# Altium project EFNMR_RT_V1.PrjPcb
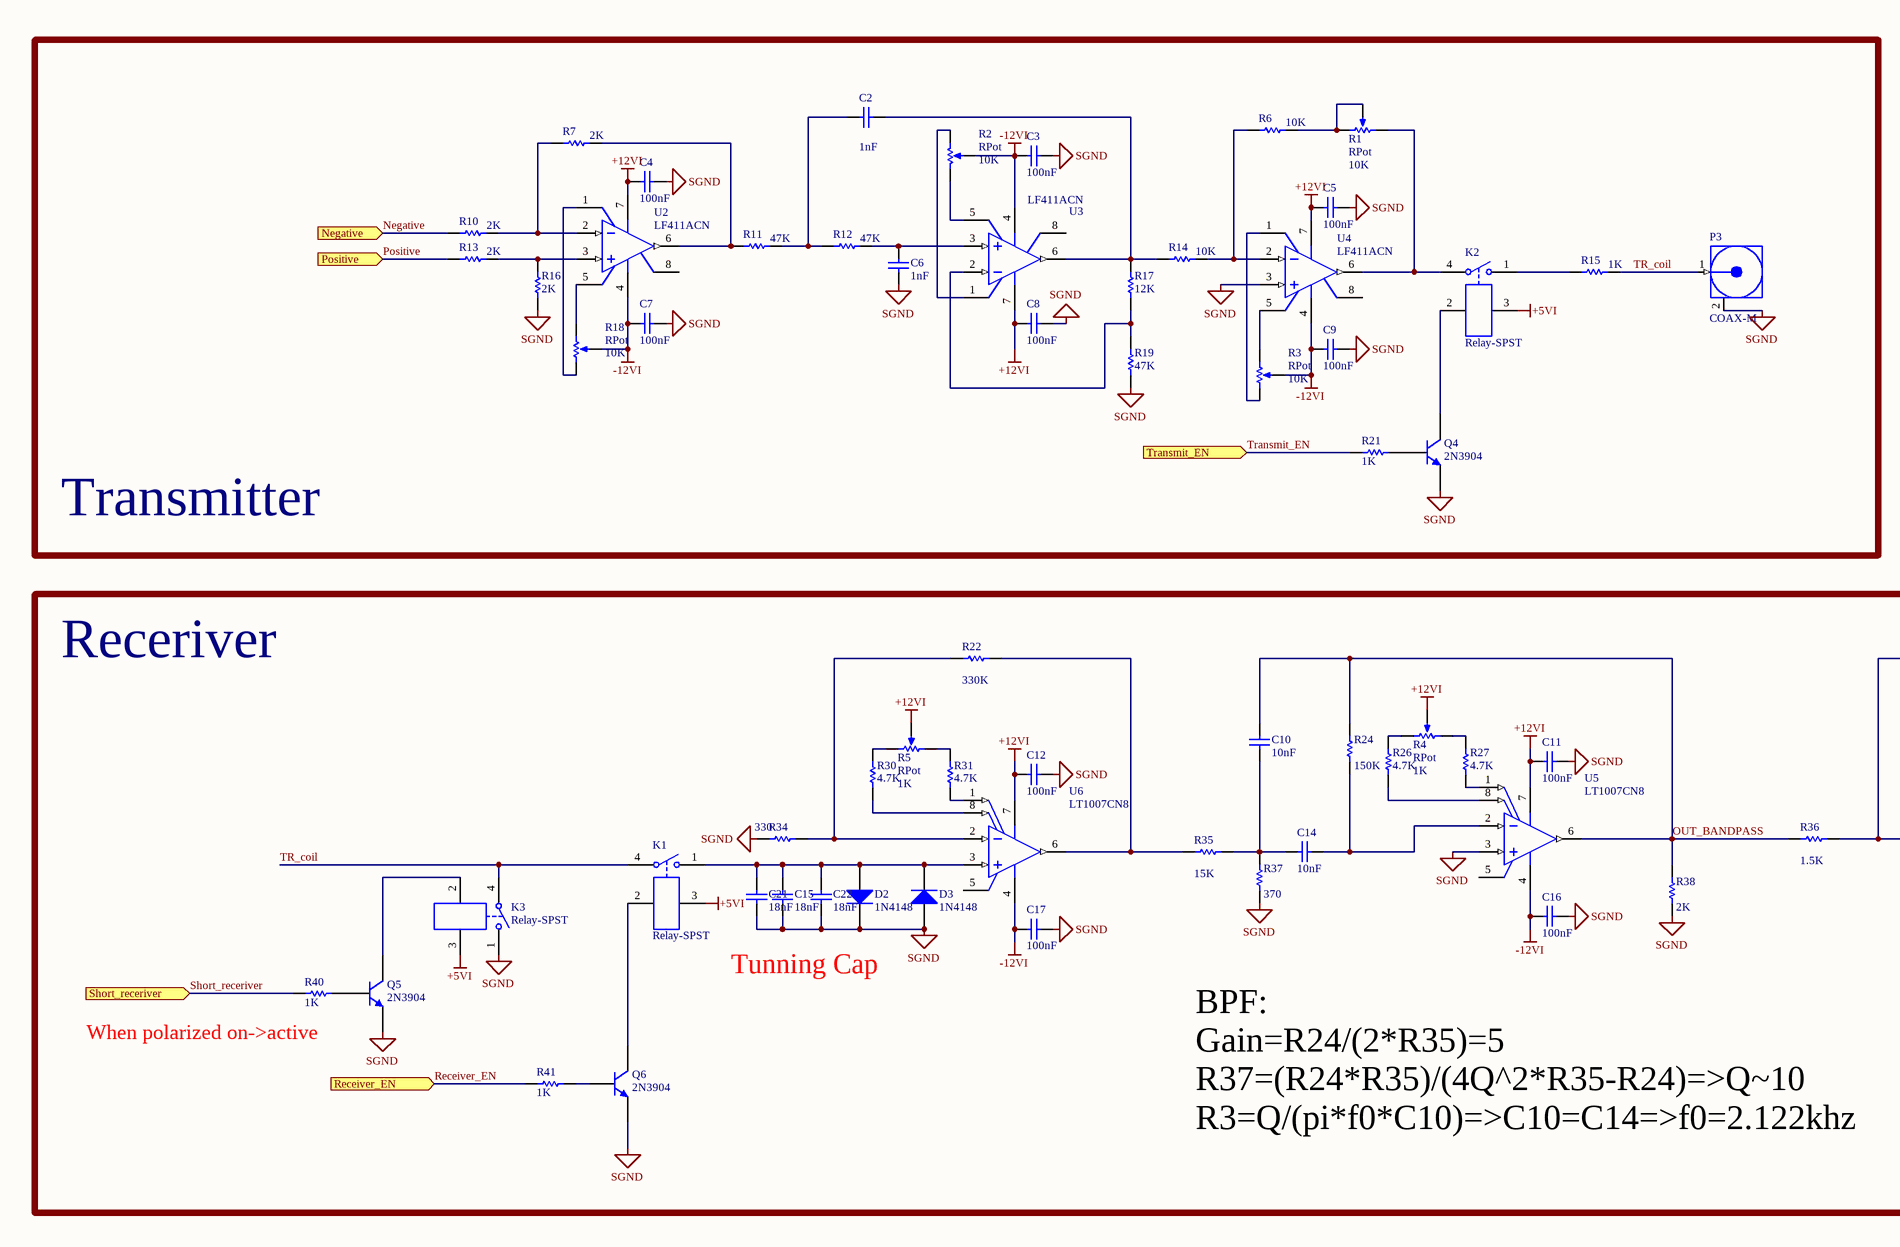
[diagram p0: EFNMR_RT_V1.SchDoc, left]
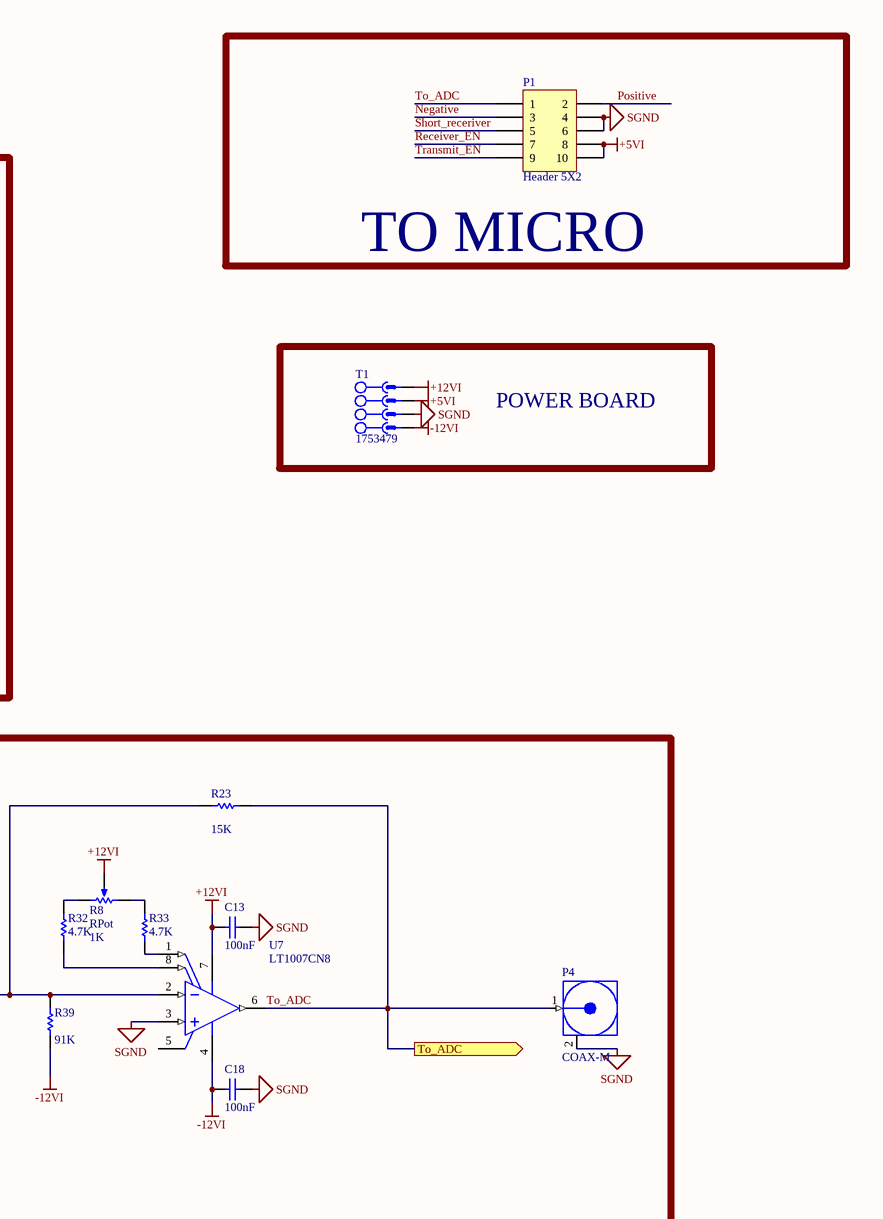
[diagram p1: EFNMR_RT_V1.SchDoc, right]
1 sheet, 73 parts. Net scope: flat (ports and power ports of the same name join across sheets).
Board file: EFNMR_RT_V1.PcbDoc

## Sheet EFNMR_RT_V1.SchDoc
size A2

### Parts
C2  value 1nF  [CAP0805]  (hidden comment: Cap)
C3  value 100nF  [CAP0805]  (hidden comment: Cap)
C4  value 100nF  [CAP0805]  (hidden comment: Cap)
C5  value 100nF  [CAP0805]  (hidden comment: Cap)
C6  value 1nF  [CAP0805]  (hidden comment: Cap)
C7  value 100nF  [CAP0805]  (hidden comment: Cap)
C8  value 100nF  [CAP0805]  (hidden comment: Cap)
C9  value 100nF  [CAP0805]  (hidden comment: Cap)
C10  10nF  [CAP0805]
C11  value 100nF  [CAP0805]  (hidden comment: Cap)
C12  value 100nF  [CAP0805]  (hidden comment: Cap)
C13  value 100nF  [CAP0805]  (hidden comment: Cap)
C14  10nF  [CAP0805]
C15  value 18nF  [CAP0805]  (hidden comment: Cap)
C16  value 100nF  [CAP0805]  (hidden comment: Cap)
C17  value 100nF  [CAP0805]  (hidden comment: Cap)
C18  value 100nF  [CAP0805]  (hidden comment: Cap)
C21  value 18nF  [CAP0805]  (hidden comment: Cap)
C22  value 18nF  [CAP0805]  (hidden comment: Cap)
D2  1N4148  [SOD80, LL-34]
D3  1N4148  [SOD80, LL-34]
K1  Relay-SPST  [HE3351A0500]
K2  Relay-SPST  [HE3351A0500]
K3  Relay-SPST  [HE3351A0500]
P1  Header 5X2  [IDC2.54-10PIN WITH CABLE]
P3  COAX-M  [SMA_RA_F]
P4  COAX-M  [SMA_RA_F]
Q4  2N3904  [TO-92A]
Q5  2N3904  [TO-92A]
Q6  2N3904  [TO-92A]
R1  RPot  value 10K  [MULTITURN_TRIMMER_3296_132]
R2  RPot  value 10K  [MULTITURN_TRIMMER_3296_132]
R3  RPot  value 10K  [MULTITURN_TRIMMER_3296_132]
R4  RPot  value 1K  [MULTITURN_TRIMMER_3296_132]
R5  RPot  value 1K  [MULTITURN_TRIMMER_3296_132]
R6  10K  [RES0805]
R7  2K  [RES0805]
R8  RPot  value 1K  [MULTITURN_TRIMMER_3296_132]
R10  2K  [RES0805]
R11  47K  [RES0805]
R12  47K  [RES0805]
R13  2K  [RES0805]
R14  10K  [RES0805]
R15  1K  [RES0805]
R16  2K  [RES0805]
R17  12K  [RES0805]
R18  RPot  value 10K  [MULTITURN_TRIMMER_3296_132]
R19  47K  [RES0805]
R21  1K  [RES0805]
R22  330K  [RES0805]
R23  15K  [RES0805]
R24  150K  [RES0805]
R26  4.7K  [RES0805]
R27  4.7K  [RES0805]
R30  4.7K  [RES0805]
R31  4.7K  [RES0805]
R32  4.7K  [RES0805]
R33  4.7K  [RES0805]
R34  330  [RES0805]
R35  15K  [RES0805]
R36  1.5K  [RES0805]
R37  370  [RES0805]
R38  2K  [RES0805]
R39  91K  [RES0805]
R40  1K  [RES0805]
R41  1K  [RES0805]
T1  1753479  [MSTBV 2,5/4-G-5]
U2  LF411ACN  [LT-N8-8]
U3  LF411ACN  [LT-N8-8]
U4  LF411ACN  [LT-N8-8]
U5  LT1007CN8  [LT-N8-8]
U6  LT1007CN8  [LT-N8-8]
U7  LT1007CN8  [LT-N8-8]

### Blocks framed on the sheet
TO MICRO: P1
Transmitter: C2-C9 K2 P3 Q4 R1-R3 R6 R7 R10-R19 R21 U2-U4
POWER BOARD: T1
Receriver: C10-C18 C21 C22 D2 D3 K1 K3 P4 Q5 Q6 R4 R5 R8 R22-R24 R26 R27 R30-R41 U5-U7

### Ports
Negative (in), Positive (in), Receiver_EN (in), Short_receriver (in), To_ADC (out), Transmit_EN (in)

### Nets
+5VI: K1.3 K2.3 K3.3 P1.8 P1.10 T1.3
+12VI: C4.2 C5.2 C8.2 C11.2 C12.2 C13.2 R4.3(TAP) R5.3(TAP) R8.3(TAP) T1.4 U2.7(V+) U3.7(V+) U4.7(V+) U5.7(V+) U6.7(V+) U7.7(V+)
-12VI: C3.2 C7.2 C9.2 C16.2 C17.2 C18.2 R2.3(TAP) R3.3(TAP) R18.3(TAP) R39.2 T1.1 U2.4(V-) U3.4(V-) U4.4(V-) U5.4(V-) U6.4(V-) U7.4(V-)
SGND: C3.1 C4.1 C5.1 C6.1 C7.1 C8.1 C9.1 C11.1 C12.1 C13.1 C15.2 C16.1 C17.1 C18.1 C21.2 C22.2 D2.2(K) D3.1(A) K3.1 P1.4 P1.6 P3.2(GND) P4.2(GND) Q4.1(E) Q5.1(E) Q6.1(E) R16.1 R19.1 R34.1 R37.2 R38.2 T1.2 U4.3(IN+) U5.3(+IN) U7.3(+IN)
Negative: P1.3 R10.1 ; port Negative
OUT_BANDPASS: C10.2 R24.1 R36.2 R38.1 U5.6(OUT)
Positive: P1.2 R13.1 ; port Positive
Receiver_EN: P1.7 R41.2 ; port Receiver_EN
Short_receriver: P1.5 R40.2 ; port Short_receriver
To_ADC: P1.1 P4.1(Signal) R23.1 U7.6(OUT) ; port To_ADC
TR_coil: K1.4 K3.4 P3.1(Signal) R15.2
Transmit_EN: P1.9 R21.2 ; port Transmit_EN
NetC2_1: C2.1 R11.2 R12.1
NetC2_2: C2.2 R14.1 R17.1 U3.6(OUT)
NetC6_2: C6.2 R12.2 U3.3(IN+)
NetC10_1: C10.1 C14.1 R35.1 R37.1
NetC14_2: C14.2 R24.2 U5.2(-IN)
NetC15_1: C15.1 C21.1 C22.1 D2.1(A) D3.2(K) K1.1 U6.3(+IN)
NetK1_2: K1.2 Q6.3(C)
NetK2_1: K2.1 R15.1
NetK2_2: K2.2 Q4.3(C)
NetK2_4: K2.4 R1.1(TOP) U4.6(OUT)
NetK3_2: K3.2 Q5.3(C)
NetQ4_2: Q4.2(B) R21.1
NetQ5_2: Q5.2(B) R40.1
NetQ6_2: Q6.2(B) R41.1
NetR1_2: R1.2(BOT) R1.3(TAP) R6.2
NetR2_1: R2.1(TOP) U3.1(BAL)
NetR2_2: R2.2(BOT) U3.5(BAL)
NetR3_1: R3.1(TOP) U4.1(BAL)
NetR3_2: R3.2(BOT) U4.5(BAL)
NetR4_1: R4.1(TOP) R27.1
NetR4_2: R4.2(BOT) R26.1
NetR5_1: R5.1(TOP) R31.1
NetR5_2: R5.2(BOT) R30.1
NetR6_1: R6.1 R14.2 U4.2(IN-)
NetR7_1: R7.1 R10.2 U2.2(IN-)
NetR7_2: R7.2 R11.1 U2.6(OUT)
NetR8_1: R8.1(TOP) R33.1
NetR8_2: R8.2(BOT) R32.1
NetR13_2: R13.2 R16.2 U2.3(IN+)
NetR17_2: R17.2 R19.2 U3.2(IN-)
NetR18_1: R18.1(TOP) U2.1(BAL)
NetR18_2: R18.2(BOT) U2.5(BAL)
NetR22_1: R22.1 R35.2 U6.6(OUT)
NetR22_2: R22.2 R34.2 U6.2(-IN)
NetR23_2: R23.2 R36.1 R39.1 U7.2(-IN)
NetR26_2: R26.2 U5.8(VOS_TRIM)
NetR27_2: R27.2 U5.1(VOS_TRIM)
NetR30_2: R30.2 U6.8(VOS_TRIM)
NetR31_2: R31.2 U6.1(VOS_TRIM)
NetR32_2: R32.2 U7.8(VOS_TRIM)
NetR33_2: R33.2 U7.1(VOS_TRIM)

Not connected (* = marked no-connect by the designer): U2 8(NC); U3 8(NC); U4 8(NC); U5 5(NC); U6 5(NC); U7 5(NC)

### Notes on the sheet
- Tunning Cap
- When polarized on->active
- BPF:
  Gain=R24/(2*R35)=5
  R37=(R24*R35)/(4Q^2*R35-R24)=>Q~10
  R3=Q/(pi*f0*C10)=>C10=C14=>f0=2.122khz

### Library data of the parts
C2-C18 C21 C22 = Cap: Capacitor; Published: 8-Jun-2000; LatestRevisionDate: 17-Jul-2002; LatestRevisionNote: Re-released for DXP Platform.; PackageReference: RAD-0.3; Publisher: Altium Limited; PackageDescription: Radial Cap, Thru-Hole; 2 Leads; 0.3 in Pin Spacing
  C10 C14: Value: 10nF
D2 D3 = 1N4148: High Conductance Fast Diode; Published: 8-Jun-2000; LatestRevisionDate: 17-Jul-2002; LatestRevisionNote: Re-released for DXP Platform.; DatasheetDocument: 1997; PackageReference: DO-35; Publisher: Altium Limited; Code_JEDEC: DO-204-AH; ComponentLink1Description: Manufacturer Link; ComponentLink1URL: http://www.fairchildsemi.com/; ComponentLink2Description: Datasheet; ComponentLink2URL: http://www.fairchildsemi.com/ds/1N%2F1N4148.pdf
K1-K3 = Relay-SPST: Single-Pole Single-Throw Relay; Published: 24-Mar-1999; LatestRevisionDate: 17-Jul-2002; LatestRevisionNote: Re-released for DXP Platform.; PackageReference: MODULE4; Publisher: Altium Limited
P1 = Header 5X2: Header, 5-Pin, Dual row; LatestRevisionDate: 17-Jul-2002; LatestRevisionNote: Re-released for DXP Platform.; Publisher: Altium Limited
P3 P4 = COAX-M: RF Coaxial PCB Connector, MMCX; Thru-Hole, Vertical Mount Plug,  50 Ohm Impedance; PackageDocument: Rev. A, 16-Jun-1997; PCB_Layout: Complies with manufacturer's recommendation.; DrillSize: Corresponds to nominal value.; Published: 15-Jul-2004; LatestRevisionDate: 15-Jul-2004; LatestRevisionNote: Component Replaced.; DatasheetDocument: 30-May-2003; PackageReference: 908-21103; Publisher: Altium Limited; ComponentLink1Description: Manufacturer Link; ComponentLink1URL: http://www.amphenolrf.com/
Q4-Q6 = 2N3904: NPN General Purpose Amplifier; Published: 8-Jun-2000; LatestRevisionDate: 15-Jan-2003; LatestRevisionNote: PCB Footprint 'BCY-W3/D4.7' replaced; DatasheetVersion: 1997; PackageVersion: Sep-1998; PackageReference: TO-92A; Publisher: Altium Limited; PackageDescription: TO, Flat Index; 3 In-Line, Axial Leads; Body Dia. 4.5mm; Leads 0.51 x 0.48 mm (max); ComponentLink1Description: Manufacturer Link; ComponentLink1URL: http://www.fairchildsemi.com/; ComponentLink2Description: Datasheet; ComponentLink2URL: http://www.fairchildsemi.com/ds/2N%2F2N3904.pdf
R1-R5 R8 R18 = RPot: Potentiometer; Sim Note: Enter the Resistance value and the set point into parameter fields.; Set Position: 0.5; Published: 8-Jun-2000; LatestRevisionDate: 17-Jul-2002; LatestRevisionNote: Re-released for DXP Platform.; PackageReference: VR5; Publisher: Altium Limited; PackageDescription: Variable Resistor, Thru-Hole; 3 Leads
R6 R7 R10-R17 R19 R21-R24 R26 R27 R30-R41 = Res1: Resistor; Published: 8-Jun-2000; LatestRevisionDate: 17-Jul-2002; LatestRevisionNote: Re-released for DXP Platform.; PackageReference: AXIAL-0.3; Publisher: Altium Limited; PackageDescription: Axial Device, Thru-Hole; 2 Leads; 0.3 in Pin Spacing
  R6 R14: Value: 10K
  R7 R10 R13 R16 R38: Value: 2K
  R11 R12 R19: Value: 47K
  R15 R21 R40 R41: Value: 1K
  R17: Value: 12K
  R22: Value: 330K
  R23 R35: Value: 15K
  R24: Value: 150K
  R26 R27 R30-R33: Value: 4.7K
  R34: Value: 330
  R36: Value: 1.5K
  R37: Value: 370
  R39: Value: 91K
T1 = CON_Phoenix_MSTBV_04: 4 Pitch: 5 mm Color: green Contact surface: Tin Assembly; Manufacturer: PHOENIX CONTACT; Connector type: PCB Terminal Block; designer: ABBAS BASEREH; Max Current: 12 A; Positions: 4; Voltage: 320 V; Category: Connector; ComponentLink1Description: Header, Nominal current: 12 A Rated voltage (III/2): 320 V Number of positions: 4 Pitch: 5 mm Color: green Contact surface: Tin Assembly: Soldering  DESIGNER:ABBAS BASEREH; ComponentLink2Description: Reference; Mounting Technology: Through-Hole; Pin Count: 4; Revision 1: 2017-3-1; Status: Unreleased; PART.NO: 1753479
U2-U4 = LF411ACN: Low Offset, Low Drift JFET Input Operational Amplifier, 8-pin MDIP; Manufacturer: National Semiconductor; PackageTopMarking: NSUZXYTTE#*LF*411ACN; PowerWise: N; CompType: Amplifiers; High-Reliability: Y; DatasheetVersion: Aug-2000; PackageVersion: revG, May-2006; PackageReference: N08E; PackageDescription: MDIP, .365 x .250 x .130in, 8 Lead, .100in Pitch; PartNumber: LF411ACN; RoHS: N; PinCount: 8; Code_JEDEC: MS-001-BA; ComponentLink1Description: Manufacturer URL; ComponentLink1URL: http://www.national.com/; ComponentLink2Description: LF411 Datasheet; ComponentLink2URL: http://www.national.com/ds/LF/LF411.pdf; ComponentLink3Description: LF411 Web Page; ComponentLink3URL: http://www.national.com/pf/LF/LF411.html; ComponentLink4Description: N08E Package Page; ComponentLink4URL: http://www.national.com/packaging/folders/n08e.html
U5-U7 = LT1007CN8: Single Channel, Low Noise, High Speed Precision Operational Amplifier, 8 MHz Typical GBW, 2.5 V/us Typical SR, 4 to 44 V, 8-Pin DIP (N8-8), Commerical; Linear Technology Part Number: LT1007; Manufacturer: Linear Technology; Channels (#): 1; GBW (MHz) Typical: 8; Is (mA) Typical: 2.6; SR (V/us) Typical: 2.5; Vos (mV) Typical: 0.01; Vs Max (V): 44; Vs Min (V): 4; DatasheetVersion: Rev. A; PackageVersion: Rev I; PackageReference: LT-N8-8; PackageDescription: 8-Lead PDIP, Body 10.16 x 6.48 mm, Pitch 2.54 mm; Supplier 1: Digi-Key; Supplier Part Number 1: LT1007CN8-ND; Type: VFB; Mounting Technology: Surface Mount; PartNumber: LT1007CN8; ComponentLink1Description: Manufacturer URL; ComponentLink1URL: http://www.linear.com/; ComponentLink2Description: Datasheet; ComponentLink2URL: http://cds.linear.com/docs/en/datasheet/1007dicedwffa.pdf; ComponentLink3Description: Package Specification; ComponentLink3URL: http://cds.linear.com/docs/en/packaging/05081510_I_N8.pdf